# EAGLE schematic schematic (EAGLE 6.5.0)
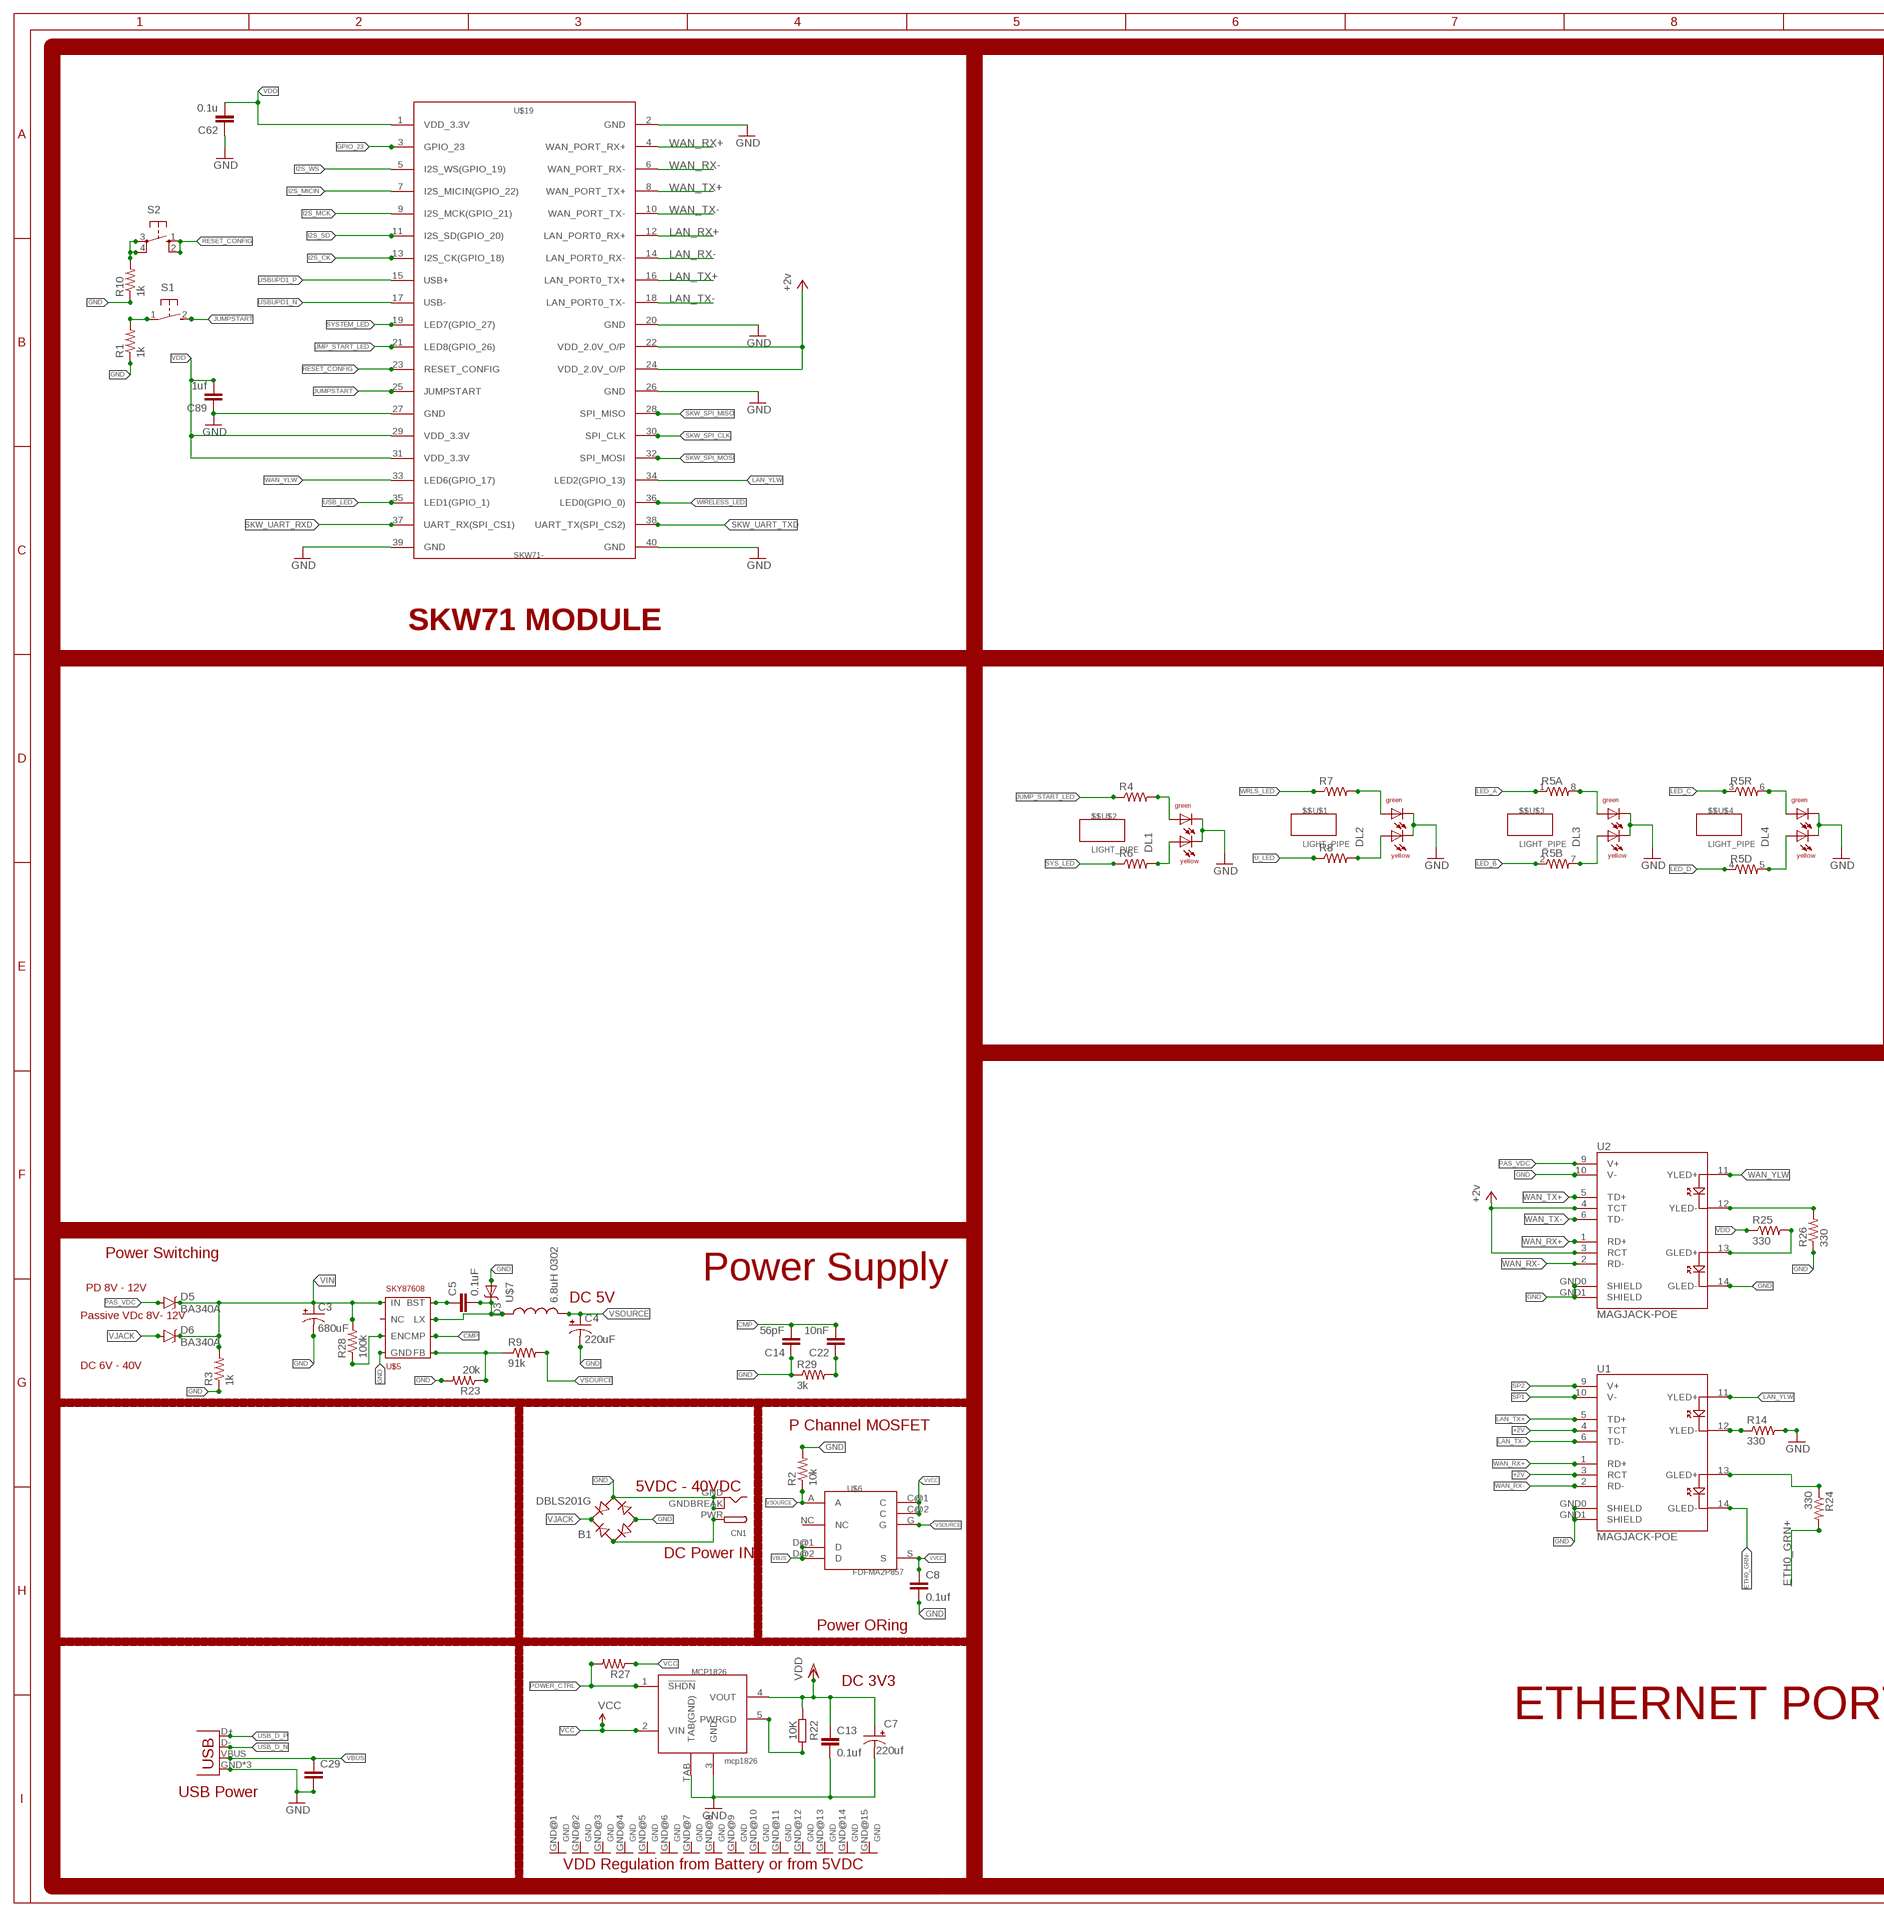
[diagram p0: schematic, sheet 1, part 1 of 2]
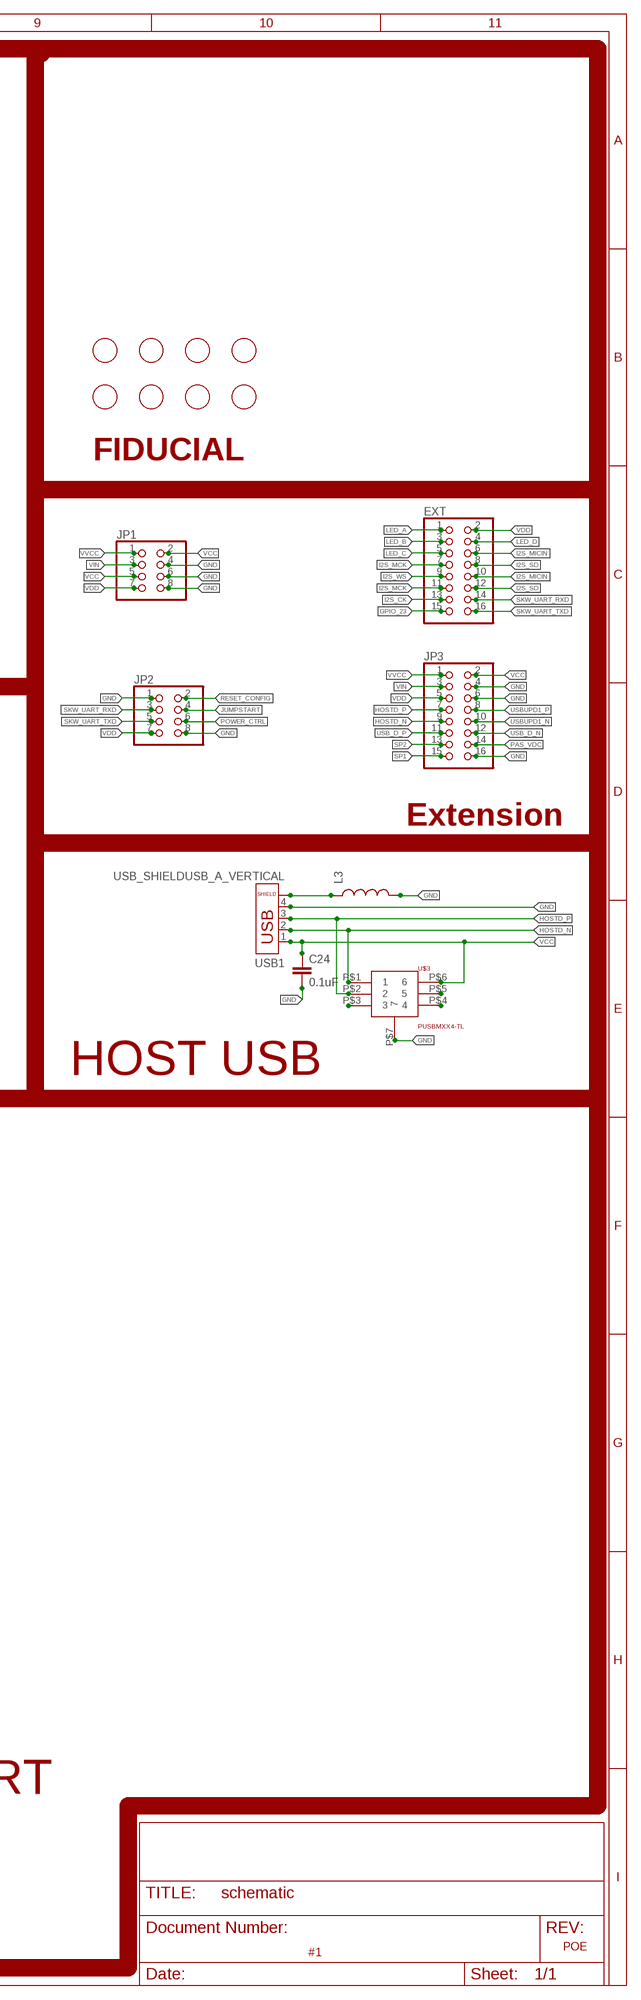
[diagram p1: schematic, sheet 1, part 2 of 2]

## Parts
$$U$1  LIGHT_PIPE  [LIGHT-PIPE]
$$U$2  LIGHT_PIPE  [LIGHT-PIPE]
$$U$3  LIGHT_PIPE  [LIGHT-PIPE]
$$U$4  LIGHT_PIPE  [LIGHT-PIPE]
B1  DBLS201G  [DBS]
C3  680uF  CPOL-USE3.5-10  [E3,5-10]
C4  220uF  CPOL-USE5-10.5  [E5-10,5]
C5  0.1uF  CAP0402-CAP  [0402-CAP]
C7  220uf  CPOL-USE5-10.5  [E5-10,5]
C8  0.1uf  C-EUC0402  [C0402]
C13  0.1uf  C-EUC0402  [C0402]
C14  56pF  CAP0402-CAP  [0402-CAP]
C22  10nF  CAP0402-CAP  [0402-CAP]
C24  0.1uF  CAP0402-CAP  [0402-CAP]
C29  CAP0402-CAP  [0402-CAP]
C62  0.1u  CAPACITOR  [C0603]
C89  1uf  CAPACITOR  [C0603]
CN1  DCBARRELPTH  [DCJACK_2MM_PTH]
D3  DIODE-SCHOTTKY_  [SMA-DIODE]
D5  BA340A  B340A  [SMA-DIODE]
D6  BA340A  B340A  [SMA-DIODE]
DL1  DUOLED-1X2  [DUOLED-C-0603]
DL2  DUOLED-1X2  [DUOLED-C-0603]
DL3  DUOLED-1X2  [DUOLED-C-0603]
DL4  DUOLED-1X2  [DUOLED-C-0603]
EXT  PINHD-2X8  [2X08]
JP1  PINHD-2X4  [2X04]
JP2  PINHD-2X4  [2X04]
JP3  PINHD-2X8  [2X08]
JP4  USB-MICROB  [USB-MICROB]
L3  INDUCTOR0402  [C0402]
MCP1826  mcp1826  MCP1825T  [SOT223-5]
R1  1k  RESISTOR0402-RES  [0402-RES]
R2  10k  RESISTOR0402-RES  [0402-RES]
R3  1k  RESISTOR0402-RES  [0402-RES]
R4  RESISTOR0402-RES  [0402-RES]
R5  RESISTOR-ARRAY0603-ARV  [0603-ARV]
R6  RESISTOR0402-RES  [0402-RES]
R7  RESISTOR0402-RES  [0402-RES]
R8  RESISTOR0402-RES  [0402-RES]
R9  91k  RESISTOR0402-RES  [0402-RES]
R10  1k  RESISTOR0402-RES  [0402-RES]
R14  330  RESISTOR0402-RES  [0402-RES]
R22  10K  R-EU_R0402  [R0402]
R23  20k  RESISTOR0402-RES  [0402-RES]
R24  330  RESISTOR0402-RES  [0402-RES]
R25  330  RESISTOR0402-RES  [0402-RES]
R26  330  RESISTOR0402-RES  [0402-RES]
R27  RESISTOR0402-RES  [0402-RES]
R28  100k  RESISTOR0402-RES  [0402-RES]
R29  3k  RESISTOR0402-RES  [0402-RES]
S1  31-XX  [B3F-31XX]
S2  10-XX  [B3F-10XX]
U1  MAGJACK-POE  [MAGJACK-POE]
U2  MAGJACK-POE  [MAGJACK-POE]
U$3  PUSBMXX4-TL  [PUSBMXX4-TL]
U$5  SKY87608  [8PIN-SOP-8L-EP]
U$6  FDFMA2P857  [6-WDFN-EXPOSED-PAD]
U$7  6.8uH 0302  INDUCTOR_0302  [0302]
U$9  FIDUCIAL  [FIDUCIAL_1MM]
U$11  FIDUCIAL  [FIDUCIAL_1MM]
U$12  FIDUCIAL  [FIDUCIAL_1MM]
U$13  FIDUCIAL  [FIDUCIAL_1MM]
U$14  FIDUCIAL  [FIDUCIAL_1MM]
U$15  FIDUCIAL  [FIDUCIAL_1MM]
U$16  FIDUCIAL  [FIDUCIAL_1MM]
U$17  FIDUCIAL  [FIDUCIAL_1MM]
U$19  SKW71-  [SKW71-SMT]
USB1  USB_SHIELDUSB_A_VERTICAL  [USB_A_VERTICAL_PTH]

## Nets
+2V [power]: U1.3(RCT) U1.4(TCT) U2.3(RCT) U2.4(TCT) U$19.22(VDD_2.0V_O/P) U$19.24(VDD_2.0V_O/P) ; supply symbol labelled +2v
CMP: C14.2 C22.2 U$5.P$6(CMP)
ETH0_GRN+: R24.2
ETH0_GRN-: U1.14(GLED-)
GND: B1.- B1.AC2 C3.- C4.- C7.- C8.2 C13.2 C14.1 C24.2 C29.2 C62.1 C89.1 CN1.GND CN1.GNDBREAK D3.A DL1.C1 DL1.C2 DL2.C1 DL2.C2 DL3.C1 DL3.C2 DL4.C1 DL4.C2 JP1.4 JP1.6 JP1.8 JP2.1 JP2.8 JP3.4 JP3.6 JP3.16 JP4.GND JP4.MT1(GND) JP4.MT2(GND) L3.2 MCP1826.3(GND) MCP1826.TAB(TAB(GND)) R1.1 R2.2 R3.1 R10.1 R14.2 R23.2 R26.1 R29.1 U1.GND0(SHIELD) U1.GND1(SHIELD) U2.10(V-) U2.14(GLED-) U2.GND0(SHIELD) U2.GND1(SHIELD) U$3.P$7 U$5.P$4(GND) U$19.2(GND) U$19.20(GND) U$19.26(GND) U$19.27(GND) U$19.39(GND) U$19.40(GND) USB1.4
GPIO_23: EXT.15 U$19.3(GPIO_23)
HOSTD_N: JP3.9 U$3.P$1 USB1.2
HOSTD_P: JP3.7 U$3.P$2 USB1.3
I2S_CK: EXT.13 U$19.13(I2S_CK(GPIO_18))
I2S_MCK: EXT.7 EXT.11 U$19.9(I2S_MCK(GPIO_21))
I2S_MICIN: EXT.6 EXT.10 U$19.7(I2S_MICIN(GPIO_22))
I2S_SD: EXT.8 EXT.12 U$19.11(I2S_SD(GPIO_20))
I2S_WS: EXT.9 U$19.5(I2S_WS(GPIO_19))
JMP_START_LED: U$19.21(LED8(GPIO_26))
JUMP_START_LED: R4.1
JUMPSTART: JP2.4 S1.2(S) U$19.25(JUMPSTART)
LAN_RX+: U$19.12(LAN_PORT0_RX+)
LAN_RX-: U$19.14(LAN_PORT0_RX-)
LAN_TX+: U1.5(TD+) U$19.16(LAN_PORT0_TX+)
LAN_TX-: U1.6(TD-) U$19.18(LAN_PORT0_TX-)
LAN_YLW: U1.11(YLED+) U$19.34(LED2(GPIO_13))
LED_A: EXT.1 R5.1
LED_B: EXT.3 R5.2
LED_C: EXT.5 R5.3
LED_D: EXT.4 R5.4
N$1: DL2.A1 R7.2
N$2: C5.2 D3.C U$5.P$2(LX) U$7.P$1
N$3: DL1.A1 R4.2
N$4: DL2.A2 R8.2
N$6: R10.2 S2.3(P) S2.4(P1)
N$8: R1.2 S1.1(P)
N$17: DL3.A2 R5.7
N$19: DL4.A1 R5.6
N$20: MCP1826.5(PWRGD) R22.2
N$22: R28.1 U$5.P$7(EN)
N$23: U2.11(YLED+)
N$24: R14.1 U1.12(YLED-)
N$25: R25.2 U2.13(GLED+)
N$26: C5.1 U$5.P$8(BST)
N$27: R9.1 R23.1 U$5.P$5(FB)
N$29: DL4.A2 R5.5
N$31: R26.2 U2.12(YLED-)
N$32: U$3.P$3
N$33: U$3.P$4
N$34: U$3.P$5
N$35: DL3.A1 R5.8
N$37: C22.1 R29.2
N$40: DL1.A2 R6.2
N$41: L3.1 USB1.P$3
N$44: B1.AC1 CN1.PWR
N$95: R24.1 U1.13(GLED+)
PAS_VDC: D5.A JP3.14 U2.9(V+)
POWER_CTRL: JP2.6 MCP1826.1(!SHDN) R27.2
RESET_CONFIG: JP2.2 S2.1(S) S2.2(S1) U$19.23(RESET_CONFIG)
SKW_SPI_CLK: U$19.30(SPI_CLK)
SKW_SPI_MISO: U$19.28(SPI_MISO)
SKW_SPI_MOSI: U$19.32(SPI_MOSI)
SKW_UART_RXD: EXT.14 JP2.3 U$19.37(UART_RX(SPI_CS1))
SKW_UART_TXD: EXT.16 JP2.5 U$19.38(UART_TX(SPI_CS2))
SP1: JP3.15 U1.10(V-)
SP2: JP3.13 U1.9(V+)
SYS_LED: R6.1
SYSTEM_LED: U$19.19(LED7(GPIO_27))
U_LED: R8.1
USB_D_N: JP3.12 JP4.D-
USB_D_P: JP3.11 JP4.D+
USB_LED: U$19.35(LED1(GPIO_1))
USBUPD1_N: JP3.10 U$19.17(USB-)
USBUPD1_P: JP3.8 U$19.15(USB+)
VBUS: C29.1 JP4.VBUS U$6.D@1(D) U$6.D@2(D)
VCC: C24.1 JP1.2 JP1.5 JP3.2 MCP1826.2(VIN) R27.1 U$3.P$6 USB1.1
VDD: C7.+ C13.1 C62.2 C89.2 EXT.2 JP1.7 JP2.7 JP3.5 MCP1826.4(VOUT) R22.1 R25.1 U$19.1(VDD_3.3V) U$19.29(VDD_3.3V) U$19.31(VDD_3.3V)
VIN: C3.+ D5.C D6.C JP1.3 JP3.3 R3.2 R28.2 U$5.P$1(IN)
VJACK: B1.+ D6.A
VSOURCE: C4.+ R2.1 R9.2 U$6.A U$6.G U$7.P$2
VVCC: C8.1 JP1.1 JP3.1 U$6.C@1(C) U$6.C@2(C) U$6.S
WAN_RX+: U1.1(RD+) U2.1(RD+) U$19.4(WAN_PORT_RX+)
WAN_RX-: U1.2(RD-) U2.2(RD-) U$19.6(WAN_PORT_RX-)
WAN_TX+: U2.5(TD+) U$19.8(WAN_PORT_TX+)
WAN_TX-: U2.6(TD-) U$19.10(WAN_PORT_TX-)
WAN_YLW: U$19.33(LED6(GPIO_17))
WIRELESS_LED: U$19.36(LED0(GPIO_0))
WRLS_LED: R7.1
Unconnected: U$5.P$3(NC) U$6.NC

## Notes on the sheet
- FIDUCIAL
- SKW71 MODULE
- Extension
- HOST USB
- Power Switching
- Power Supply
- PD 8V - 12V
- DC 5V
- Passive VDc 8V- 12V
- DC 6V - 40V
- P Channel MOSFET
- 5VDC - 40VDC
- DC Power IN
- Power ORing
- DC 3V3
- ETHERNET PORT
- USB Power
- VDD Regulation from Battery or from 5VDC
- POE
- #1

## Power pins joined to a net without a drawn wire
GND: MCP1826.GND@1(GND) MCP1826.GND@2(GND) MCP1826.GND@3(GND) MCP1826.GND@4(GND) MCP1826.GND@5(GND) MCP1826.GND@6(GND) MCP1826.GND@7(GND) MCP1826.GND@8(GND) MCP1826.GND@9(GND) MCP1826.GND@10(GND) MCP1826.GND@11(GND) MCP1826.GND@12(GND) MCP1826.GND@13(GND) MCP1826.GND@14(GND) MCP1826.GND@15(GND)

## Library data of the parts
$$U$1-$$U$4 = BaseApp:LIGHT_PIPE: Digikey No :- __492-1313-ND__
B1 = rectifier:DB?*G: Single Phase 1.0 AMP Glass Passivated Bridge Rectifier Taiwan Semiconductor Co.,Ltd. - TSC Source: http://www.taiwansemi.com/TSCbig5/ezcatfiles/cust/img/img/db101g.pdf http://www.ts.com.tw/db/pictures/modules/PDT/PDT060207001/DBLS201G.pdf
C3 C4 = schematic:CPOL-US: POLARIZED CAPACITOR, American symbol
C5 C14 C22 C24 C29 = SparkFun-Capacitors:CAP: Capacitor Standard 0603 ceramic capacitor, and 0.1" leaded capacitor.
C7 = adafruit:CPOL-US: POLARIZED CAPACITOR, American symbol
C8 C13 = rcl:C-EU: CAPACITOR, European symbol
C62 C89 = BaseApp:CAPACITOR: C0402 & C0603 are general chip capacitors Film Capacitor, 400V's Mouser Part No :- __ECQ-E4474KF__
CN1 = adafruit:DCBARREL: 2.0mm DC Barrel Jack DCJACK_2MM_PTH - Through Hole Jack (4UConnector: 05537)
D3 = schematic:DIODE-SCHOTTKY
D5 D6 = SparkFun-DiscreteSemi:B340A: Schottky Diode 3A-40V; PROD_ID: DIO-09886
DL1-DL4 = BaseApp:DUOLED-1X2: Digikey No :- __754-1146-1-ND__
EXT JP3 = pinhead:PINHD-2X8: PIN HEADER
JP1 JP2 = pinhead:PINHD-2X4: PIN HEADER
JP4 = SparkFun-Connectors:USB: USB Connectors USB-B-PTH is fully proven SKU : PRT-00139/CONN-08278 USB-miniB is fully proven SKU : PRT-00587 USB-A-PCB is untested. USB-A-H is throughly reviewed, but untested. Spark Fun Electronics SKU : PRT-00437 USB-B-SMT is throughly reviewed, but untested. Needs silkscreen touching up. USB-A-S has not been used/tested USB-MB-H has not been used/tested USB-MICROB has been used. CONN-09505; PROD_ID: CONN-09505
L3 = SparkFun-Passives:INDUCTOR: Inductors Basic Inductor/Choke - 0603 and 1206. Footprints are not proven and vary greatly between part numbers. SRN6045- 33uH, 20% 1.4A SDR0403-560KL - 56uH, 10%, 500mA RMS/740mA peak
MCP1826 = BaseApp:MCP1825T: Digikey No:- __MCP1825T-5002E/DCCT-ND__
R1-R3 R9 R10 R14 R23-R29 = SparkFun-Passives:RESISTOR: Resistor Basic schematic elements and footprints for 0603, 1206, and PTH resistors.
R4 R6-R8 = SparkFun:RESISTOR: Resistor Basic schematic elements and footprints for 0603, 1206, and PTH resistors.
R5 = SparkFun-Resistors:RESISTOR-ARRAY: Array Chip Resistor Source: RS Component / Phycomp
R22 = resistor:R-EU_: RESISTOR, European symbol
S1 = switch-omron:31-XX: OMRON SWITCH; MPN: B3F-3100; OC_FARNELL: 959704; OC_NEWARK: 36M3582
S2 = switch-omron:10-XX: OMRON SWITCH; MPN: B3F-1000; OC_FARNELL: 176432; OC_NEWARK: 36M3542
U1 U2 = SparkFun-Connectors:MAGJACK-POE: PoE compatible MagJack
U$3 = schematic:PUSBMXX4-TL
U$5 = schematic:SKY87608
U$6 = BaseApp:FDFMA2P857
U$7 = schematic:INDUCTOR_0302
U$9 U$11-U$17 = adafruit:FIDUCIAL: For use by pick and place machines to calibrate the vision/machine, 1mm By microbuilder.eu
U$19 = BaseApp:SKW71
USB1 = schematic:USB_SHIELD

## Net classes
0 default: width 0.152 mm, drill 0.305 mm, clearance 0.152 mm
1 power: width 0.152 mm, drill 0.305 mm, clearance 0.152 mm
2 gnd: width 0.152 mm, drill 0.305 mm, clearance 0.152 mm